# EAGLE board ESP32-P4 Display 10.1 inch V1.0 (EAGLE 9.6.2), part 1 of 4
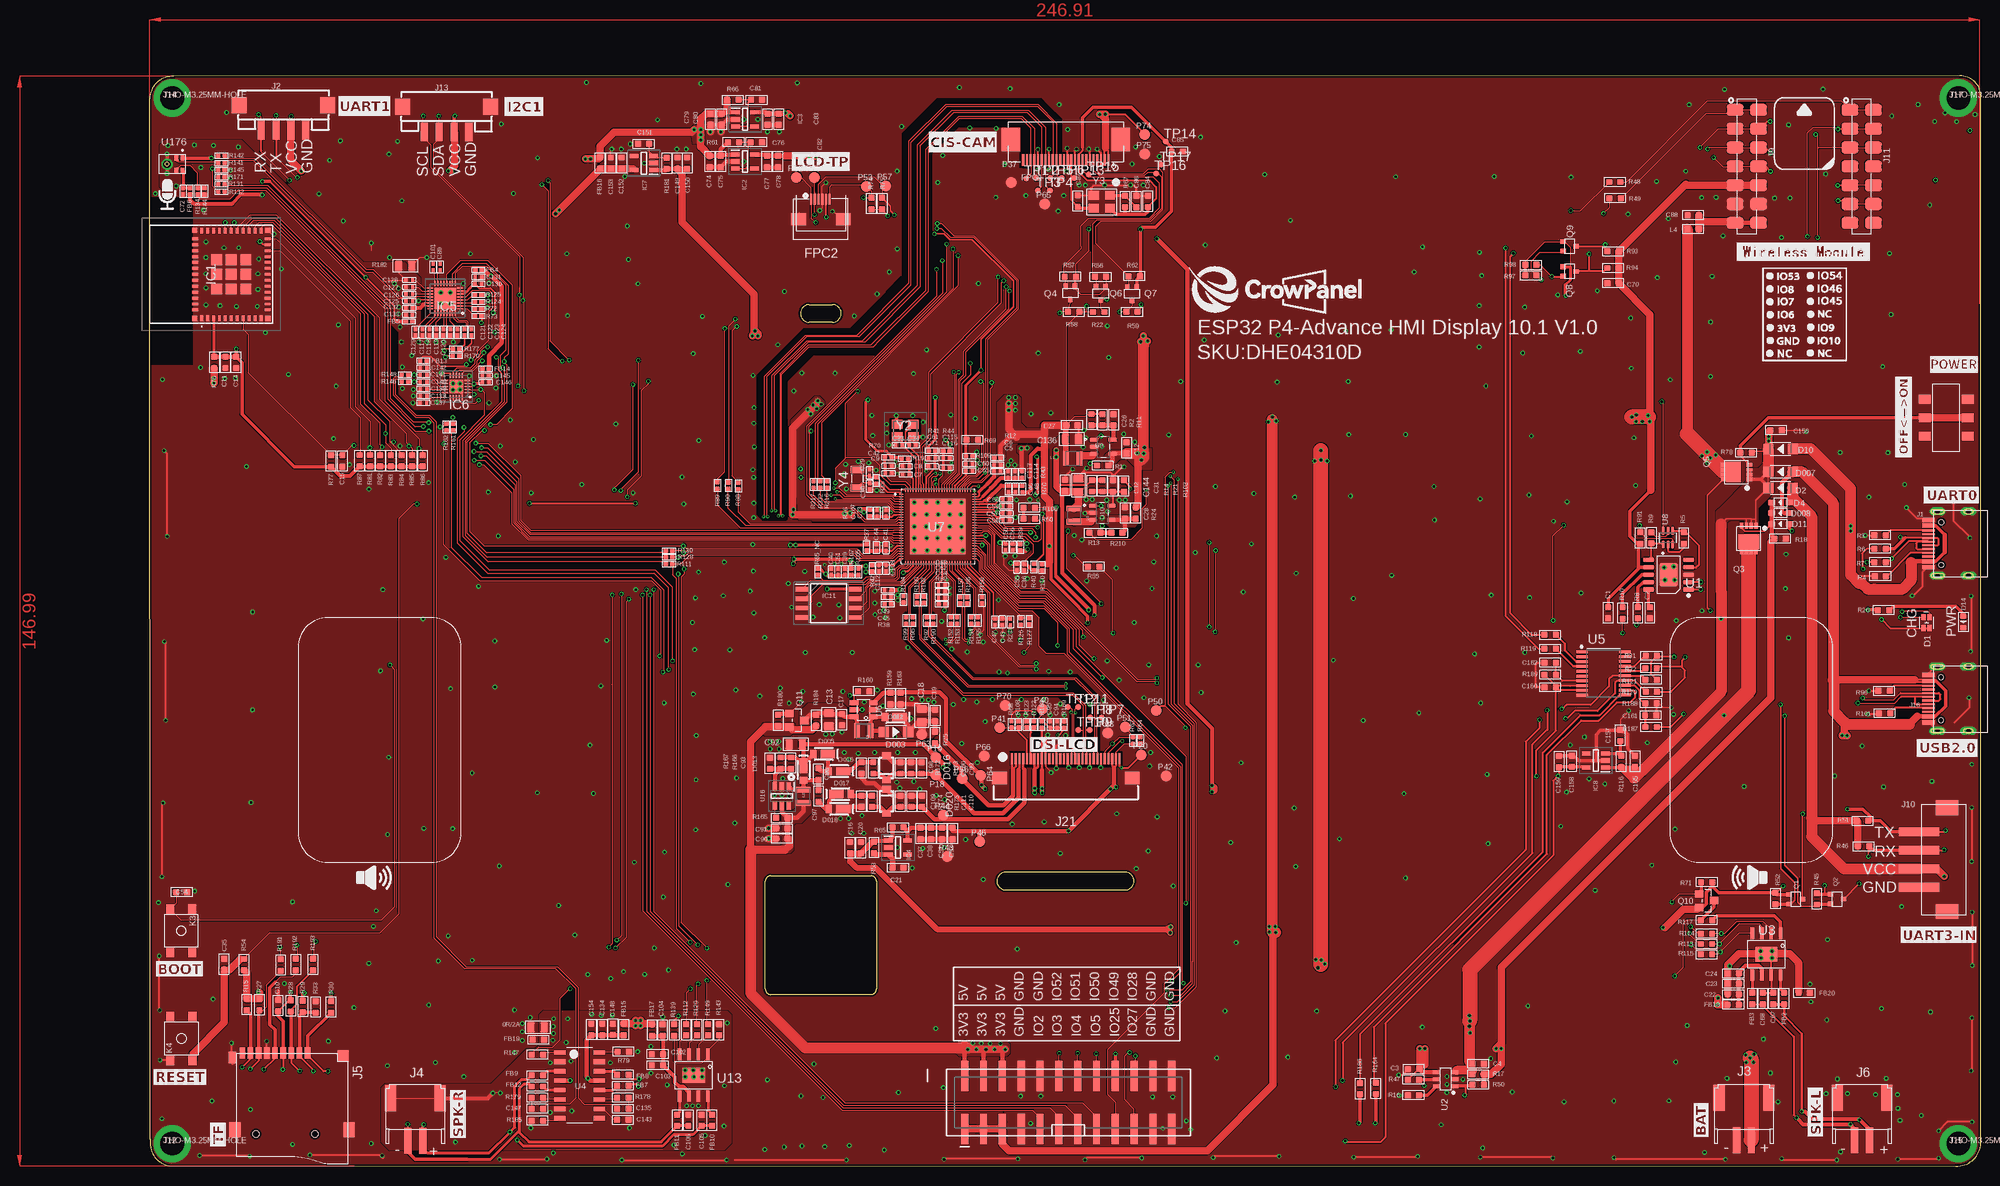
[diagram p10: board, top side]
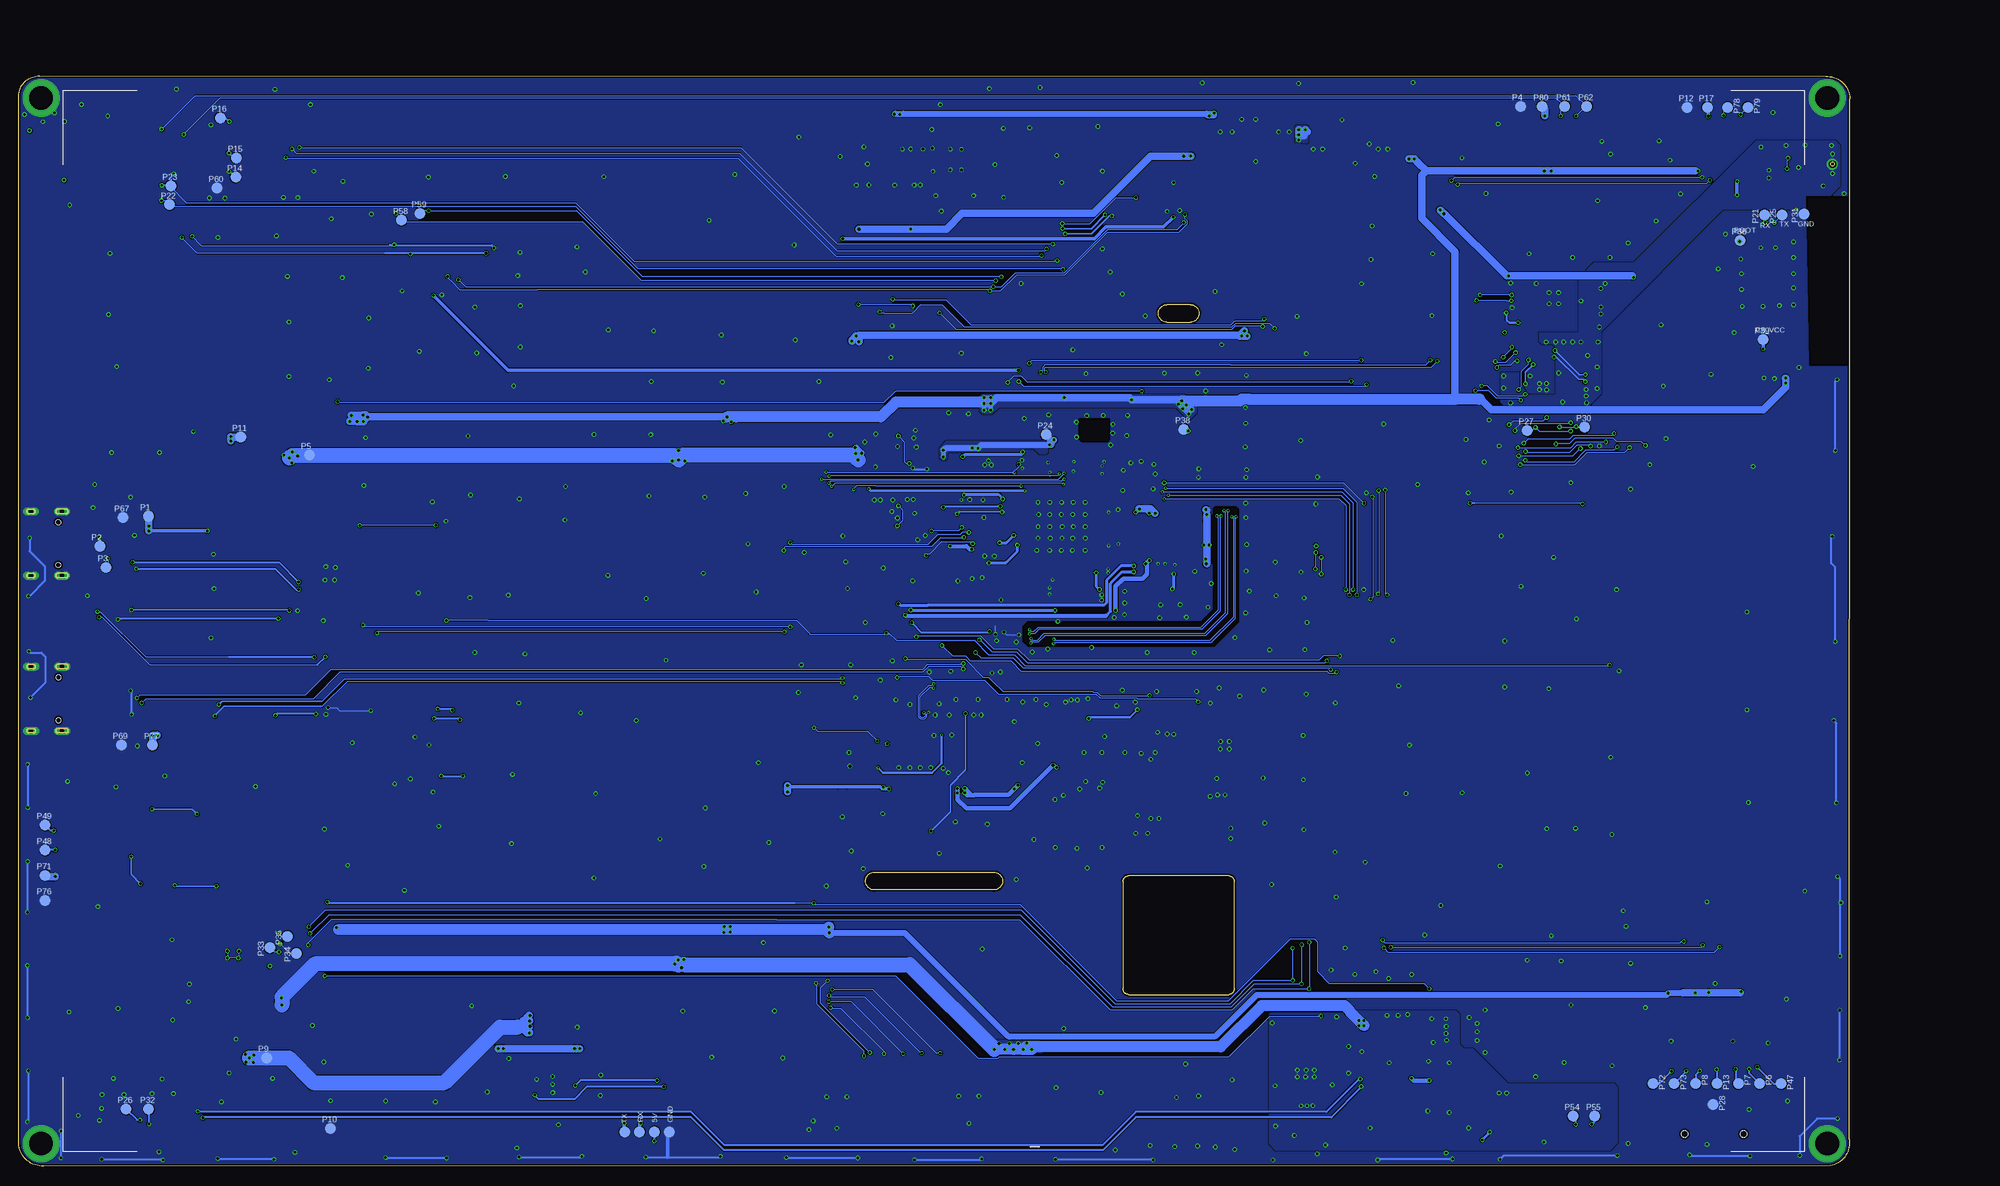
[diagram p11: board, bottom side, seen from below]

Size 247.04 x 147.01 mm. Coordinates in mm from the lower left corner, seen from the top.
Outline: 0.11,3.64 0,143.96 arc-90 3.28,146.96 244.18,147.01 arc-90 247.04,144.29 247.04,3.06 arc-90 243.64,0 2.67,0.03 arc-90 0.11,3.64
Outline: 115.49,37.24 131.61,37.24 arc180 131.61,39.62 115.49,39.62 arc180 115.49,37.24
Outline: 97.3,23.13 83.8,23.13 arc-90 83.05,23.88 83.05,38.38 arc-90 83.8,39.13 97.3,39.13 arc-90 98.05,38.38 98.05,23.88 arc-90 97.3,23.13
Outline: 92.11,113.8 88.99,113.8 arc-180 88.99,116.18 92.11,116.18 arc-180 92.11,113.8
Outline: circle at 2.38,135.11 radius 0.25
Copper layers (1*16): Top 0.035mm / dielectric 1.5mm / Bottom 0.035mm
Design rules "default *": minimum track width 4mil, minimum drill 0.2mm, track to track 4mil, track to pad 5mil, pad to pad 5mil, via to via 5mil, smd to smd 5mil, copper to edge 10mil, drill to drill 5mil, minimum pad ring 10mil, minimum via ring 4mil, stop-mask expansion 4mil, vias tented up to drill 30mil, thermal gap 6mil

## Footprints (pad centres in the part's own frame; a part is rotated, then mirrored left to right if it is on the bottom)
L0805 = smd 1.016 x 1.397: 1 -0.889,0; 2 0.889,0
0603 = smd 0.889 x 0.889: 1 -0.762,0; 2 0.762,0
C0402 = smd 0.6 x 0.6: 1 -0.45,0; 2 0.45,0
C0805 = smd 1.016 x 1.397: 1 -0.889,0; 2 0.889,0
0805 = smd 1.016 x 1.397: 1 -0.889,0; 2 0.889,0
LED_KT-0603RYG = smd 0.85 x 0.6: 1 0.725,-0.425; 2 0.725,0.425; 3 -0.725,-0.425; 4 -0.725,0.425
D_SOD123FL = smd 1.397 x 1.397: + -1.651,0; - 1.651,0
D_SOD323 = smd 1 x 0.8: + -1.2,0; - 1.2,0
LMBR140ET1G = smd 2 x 1.1: 1 -0.975,0 | smd 0.9 x 1.1: 2 0.975,0
LED0603 = smd 0.762 x 0.889: + -0.762,0; - 0.762,0
LMSZ5233BT1G = smd 0.91 x 1.22: 1 -1.635,0; 2 1.635,0
L0603 = smd 0.889 x 0.889: 1 -0.762,0; 2 0.762,0
L0402 = smd 0.635 x 0.635: 1 -0.445,0; 2 0.445,0
R0402 = smd 0.635 x 0.635: 1 -0.445,0; 2 0.445,0
FPC-SMD_P0.50-24P_QCHF-SM-H2.0 = smd 0.3 x 1.5: 1 5.75,-1.574; 2 5.25,-1.574; 3 4.75,-1.574; 4 4.25,-1.574; 5 3.75,-1.574; 6 3.25,-1.574; 7 2.75,-1.574; 8 2.25,-1.574; 9 1.75,-1.574; 10 1.25,-1.574; 11 0.75,-1.574; 12 0.25,-1.574; 13 -0.25,-1.574; 14 -0.75,-1.574; 15 -1.25,-1.574; 16 -1.75,-1.574; 17 -2.25,-1.574; 18 -2.75,-1.574; 19 -3.25,-1.574; 20 -3.75,-1.574; 21 -4.25,-1.574; 22 -4.75,-1.574; 23 -5.25,-1.574; 24 -5.75,-1.574 | smd 2.5 x 3.2: 25 7.4,1.195; 26 -7.4,1.195
FPC-6PIN-0.5MM = smd 0.3 x 1.5: 1 -1.31,2.184; 2 -0.81,2.184; 3 -0.31,2.184; 4 0.19,2.184; 5 0.69,2.184; 6 1.19,2.184 | smd 2 x 1.6: 7 -3.01,-0.496; 8 3.036,-0.496
ESP32C6MINI1N4 = smd 0.8 x 0.4: 1 -5.9,4; 2 -5.9,3.2; 3 -5.9,2.4; 4 -5.9,1.6; 5 -5.9,0.8; 6 -5.9,0; 7 -5.9,-0.8; 8 -5.9,-1.6; 9 -5.9,-2.4; 10 -5.9,-3.2; 11 -5.9,-4; 25 5.9,-4; 26 5.9,-3.2; 27 5.9,-2.4; 28 5.9,-1.6; 29 5.9,-0.8; 30 5.9,0; 31 5.9,0.8; 32 5.9,1.6; 33 5.9,2.4; 34 5.9,3.2; 35 5.9,4 | smd 0.4 x 0.8: 12 -4.8,-4.9; 13 -4,-4.9; 14 -3.2,-4.9; 15 -2.4,-4.9; 16 -1.6,-4.9; 17 -0.8,-4.9; 18 0,-4.9; 19 0.8,-4.9; 20 1.6,-4.9; 21 2.4,-4.9; 22 3.2,-4.9; 23 4,-4.9; 24 4.8,-4.9; 36 4.8,4.9; 37 4,4.9; 38 3.2,4.9; 39 2.4,4.9; 40 1.6,4.9; 41 0.8,4.9; 42 0,4.9; 43 -0.8,4.9; 44 -1.6,4.9; 45 -2.4,4.9; 46 -3.2,4.9; 47 -4,4.9; 48 -4.8,4.9 | smd 1.45 x 1.45: 49 0,0; 54 -1.975,1.975; 55 -1.975,0; 56 -1.975,-1.975; 57 0,-1.975; 58 1.975,-1.975; 59 1.975,0; 60 1.975,1.975; 61 0,1.975 | smd 0.7 x 0.7: 50 5.95,4.95; 51 5.95,-4.95; 52 -5.95,-4.95; 53 -5.95,4.95
SOT95P282X145-5N = smd 1.2 x 0.6: 1 -1.3,0.95; 2 -1.3,0; 3 -1.3,-0.95; 4 1.3,-0.95; 5 1.3,0.95
QFN40P400X400X80-33N = smd 0.75 x 0.2: 1 -2,1.4; 2 -2,1; 3 -2,0.6; 4 -2,0.2; 5 -2,-0.2; 6 -2,-0.6; 7 -2,-1; 8 -2,-1.4; 17 2,-1.4; 18 2,-1; 19 2,-0.6; 20 2,-0.2; 21 2,0.2; 22 2,0.6; 23 2,1; 24 2,1.4 | smd 0.2 x 0.75: 9 -1.4,-2; 10 -1,-2; 11 -0.6,-2; 12 -0.2,-2; 13 0.2,-2; 14 0.6,-2; 15 1,-2; 16 1.4,-2; 25 1.4,2; 26 1,2; 27 0.6,2; 28 0.2,2; 29 -0.2,2; 30 -0.6,2; 31 -1,2; 32 -1.4,2 | smd 2.9 x 2.9: 33 0,0
QFN40P300X300X60-21N = smd 0.75 x 0.2: 1 -1.5,0.8; 2 -1.5,0.4; 3 -1.5,0; 4 -1.5,-0.4; 5 -1.5,-0.8; 11 1.5,-0.8; 12 1.5,-0.4; 13 1.5,0; 14 1.5,0.4; 15 1.5,0.8 | smd 0.2 x 0.75: 6 -0.8,-1.5; 7 -0.4,-1.5; 8 0,-1.5; 9 0.4,-1.5; 10 0.8,-1.5; 16 0.8,1.5; 17 0.4,1.5; 18 0,1.5; 19 -0.4,1.5; 20 -0.8,1.5 | smd 1.8 x 1.8: 21 0,0
SOIC127P790X216-8N = smd 1.65 x 0.65: 1 -3.6,1.905; 2 -3.6,0.635; 3 -3.6,-0.635; 4 -3.6,-1.905; 5 3.6,-1.905; 6 3.6,-0.635; 7 3.6,0.635; 8 3.6,1.905
USB-3.0TYPEC-SMD = smd 0.3 x 1.7: A1 -3.35,0.5; A4 -2.55,0.5; A5 -1.25,0.5; A6 -0.25,0.5; A7 0.25,0.5; A8 1.25,0.5; A9 2.55,0.5; A12 3.35,0.5; B1 3.05,0.5; B4 2.25,0.5; B5 1.75,0.5; B6 0.75,0.5; B7 -0.75,0.5; B8 -1.75,0.5; B9 -2.25,0.5; B12 -3.05,0.5 | drill 0.6 pad 1.016 long: P$1 -4.325,-0.72; P$2 4.325,-0.72; P$3 -4.325,-4.9; P$4 4.325,-4.9 | hole 0.68: -2.89,-1.22; 2.89,-1.22
CONNECTOR_4P-SMD-2.0 = smd 0.965 x 2.54: 1 -3,0; 2 -1,0; 3 1,0; 4 3,0 | smd 2.032 x 2.184: SS1 -5.946,3.4; SS2 5.946,3.4
PH2.0WT-2PIN = smd 1 x 3.5: P$1 -1,0; P$2 1,0 | smd 1.5 x 3.5: P$3 -3.35,-5.7; P$4 3.35,-5.7
9P-SMD-W/-RING = smd 1.524 x 0.762: 1 0,4.4; 2 0,3.3; 3 0,2.2; 4 0,1.1; 5 0,0; 6 0,-1.1; 7 0,-2.2; 8 0,-3.3; 9 0,-4.4 | smd 1.524 x 1.016: G1 0.6,-5.746 | smd 2.032 x 1.524: G2 10.373,-5.4; G3 10.373,10 | smd 1.524 x 1.524: G4 0.392,9.181 | hole 0.889: 10.9,-2.6; 10.9,5.4
2X12-SMD1 = smd 4.14 x 0.991: 1 -3.569,13.97; 2 3.569,13.97; 3 -3.569,11.43; 4 3.569,11.43; 5 -3.569,8.89; 6 3.569,8.89; 7 -3.569,6.35; 8 3.569,6.35; 9 -3.569,3.81; 10 3.569,3.81; 11 -3.569,1.27; 12 3.569,1.27; 13 -3.569,-1.27; 14 3.569,-1.27; 15 -3.569,-3.81; 16 3.569,-3.81; 17 -3.569,-6.35; 18 3.569,-6.35; 19 -3.569,-8.89; 20 3.569,-8.89; 21 -3.569,-11.43; 22 3.569,-11.43; 23 -3.569,-13.97; 24 3.569,-13.97
TEST-PIN-4-2.0MM = smd 1.5 x 1.5: 1 -3,0; 2 -1,0; 3 1,0; 4 3,0
H7-2.54-18.28X2.5X5MM = smd 1.65 x 2.3: 1 -7.62,-1.58; 1-1 -7.62,1.58; 2 -5.08,-1.58; 2-2 -5.08,1.58; 3 -2.54,-1.58; 3-3 -2.54,1.58; 4 0,-1.58; 4-4 0,1.58; 5 2.54,-1.58; 5-5 2.54,1.58; 6 5.08,-1.58; 6-6 5.08,1.58; 7 7.62,-1.58; 7-7 7.62,1.58
XH2.54-4P-SMD = smd 1.2 x 5.5: 1 -3.75,-1.875; 2 -1.25,-1.875; 3 1.25,-1.875; 4 3.75,-1.875 | smd 2 x 3: 5 -7,1.875; 6 7,1.875
THO-M3.2*5MM-HOLE = drill 3.2 pad 5: P$1 0,0
C23398852_30P_0.5MM_下接_FC-05A30P11H20 = smd 0.3 x 1.5: 1 -7.25,1.3; 2 -6.75,1.3; 3 -6.25,1.3; 4 -5.75,1.3; 5 -5.25,1.3; 6 -4.75,1.3; 7 -4.25,1.3; 8 -3.75,1.3; 9 -3.25,1.3; 10 -2.75,1.3; 11 -2.25,1.3; 12 -1.75,1.3; 13 -1.25,1.3; 14 -0.75,1.3; 15 -0.25,1.3; 16 0.25,1.3; 17 0.75,1.3; 18 1.25,1.3; 19 1.75,1.3; 20 2.25,1.3; 21 2.75,1.3; 22 3.25,1.3; 23 3.75,1.3; 24 4.25,1.3; 25 4.75,1.3; 26 5.25,1.3; 27 5.75,1.3; 28 6.25,1.3; 29 6.75,1.3; 30 7.25,1.3 | smd 2 x 1.7: 31 8.95,-1.3; 32 -8.95,-1.3
KEY-4.5X4.5-SMD = smd 1.35 x 1.1: 1 -2.925,1.5; 2 -2.925,-1.5; 3 2.925,-1.5; 4 2.925,1.5
1008(2520) = smd 0.8 x 2: 1 -0.9,0; 2 0.9,0
TEST_PAD-1.5MM = smd 1.5 x 1.5: P$1 0,0
MOS_SOT323 = smd 0.635 x 0.762: 1 -0.635,-0.889; 2 0.635,-0.889; 3 0,0.889
PDFN3333 = smd 0.5 x 0.8: 1 -0.975,-1.725; 2 -0.325,-1.725; 4 0.975,-1.725; 5 0.975,1.725; 6 0.325,1.725; 7 -0.325,1.725; 8 -0.975,1.725 | smd 0.4 x 0.8: 3 0.325,-1.725 | smd 2.8 x 2: 9 0,0.4
PMOS_SOT23 = smd 1.016 x 1.143: 1 -0.889,-1.016; 2 0.889,-1.016; 3 0,1.016
R0603 = smd 0.889 x 0.889: 1 -0.762,0; 2 0.762,0
R0603-SP = smd 0.889 x 0.889: 1 -0.762,0; 2 0.762,0
R0805 = smd 1.016 x 1.397: 1 -0.889,0; 2 0.889,0
SWITCH_6PIN_2P = smd 1.2 x 1.6: 1 2.5,-2.9; 2 0,-2.9; 3 -2.5,-2.9; 4 -2.5,2.9; 5 0,2.9; 6 2.5,2.9
TP08R = smd 0.8 x 0.8: TP 0,0
ESOP-10-EP-150MIL = smd 1.5 x 0.6: 1 -2.7,2; 2 -2.7,1; 3 -2.7,0; 4 -2.7,-1; 5 -2.7,-2; 6 2.7,-2; 7 2.7,-1; 8 2.7,0; 9 2.7,1; 10 2.7,2 | smd 2.4 x 3.2: EP 0,0
SOT23-6L = smd 0.5 x 0.9: 1 -0.961,-1.212; 2 -0.011,-1.212; 3 0.94,-1.212; 4 0.94,1.288; 5 -0.011,1.288; 6 -0.961,1.288
NS4168-ESOP-8 = smd 1.6 x 0.5: 1 -2.8,1.905; 2 -2.8,0.635; 3 -2.8,-0.635; 4 -2.8,-1.905; 5 2.8,-1.905; 6 2.8,-0.635; 7 2.8,0.635; 8 2.8,1.905 | smd 2 x 3: 9 0,0
SOP16 = smd 0.635 x 1.524: 1 0,0; 2 1.27,0; 3 2.54,0; 4 3.81,0; 5 5.08,0; 6 6.35,0; 7 7.62,0; 8 8.89,0; 9 8.89,5.334; 10 7.62,5.334; 11 6.35,5.334; 12 5.08,5.334; 13 3.81,5.334; 14 2.54,5.334; 15 1.27,5.334; 16 0,5.334
TSSOP20 = smd 1.572 x 0.41: 1 -2.872,2.275; 2 -2.872,1.625; 3 -2.872,0.975; 4 -2.872,0.325; 5 -2.872,-0.325; 6 -2.872,-0.975; 7 -2.872,-1.625; 8 -2.872,-2.275; 9 -2.872,-2.895; 10 -2.872,-3.545; 11 2.872,-3.515; 12 2.872,-2.865; 13 2.872,-2.215; 14 2.872,-1.565; 15 2.872,-0.915; 16 2.872,-0.265; 17 2.872,0.355; 18 2.872,1.005; 19 2.872,1.625; 20 2.872,2.275
COOPER_SOT23-6 = smd 0.69 x 1.2: 1 -0.95,-1.3; 2 0,-1.3; 3 0.95,-1.3; 4 0.95,1.3; 5 0,1.3; 6 -0.95,1.3
IC_ESP32-P4NRW32 = smd 0.65 x 0.18: 1 -4.925,4.375; 2 -4.925,4.025; 3 -4.925,3.675; 4 -4.925,3.325; 5 -4.925,2.975; 6 -4.925,2.625; 7 -4.925,2.275; 8 -4.925,1.925; 9 -4.925,1.575; 10 -4.925,1.225; 11 -4.925,0.875; 12 -4.925,0.525; 13 -4.925,0.175; 14 -4.925,-0.175; 15 -4.925,-0.525; 16 -4.925,-0.875; 17 -4.925,-1.225; 18 -4.925,-1.575; 19 -4.925,-1.925; 20 -4.925,-2.275; 21 -4.925,-2.625; 22 -4.925,-2.975; 23 -4.925,-3.325; 24 -4.925,-3.675; 25 -4.925,-4.025; 26 -4.925,-4.375; 53 4.925,-4.375; 54 4.925,-4.025; 55 4.925,-3.675; 56 4.925,-3.325; 57 4.925,-2.975; 58 4.925,-2.625; 59 4.925,-2.275; 60 4.925,-1.925; 61 4.925,-1.575; 62 4.925,-1.225; 63 4.925,-0.875; 64 4.925,-0.525; 65 4.925,-0.175; 66 4.925,0.175; 67 4.925,0.525; 68 4.925,0.875; 69 4.925,1.225; 70 4.925,1.575; 71 4.925,1.925; 72 4.925,2.275; 73 4.925,2.625; 74 4.925,2.975; 75 4.925,3.325; 76 4.925,3.675; 77 4.925,4.025; 78 4.925,4.375 | smd 0.18 x 0.65: 27 -4.375,-4.925; 28 -4.025,-4.925; 29 -3.675,-4.925; 30 -3.325,-4.925; 31 -2.975,-4.925; 32 -2.625,-4.925; 33 -2.275,-4.925; 34 -1.925,-4.925; 35 -1.575,-4.925; 36 -1.225,-4.925; 37 -0.875,-4.925; 38 -0.525,-4.925; 39 -0.175,-4.925; 40 0.175,-4.925; 41 0.525,-4.925; 42 0.875,-4.925; 43 1.225,-4.925; 44 1.575,-4.925; 45 1.925,-4.925; 46 2.275,-4.925; 47 2.625,-4.925; 48 2.975,-4.925; 49 3.325,-4.925; 50 3.675,-4.925; 51 4.025,-4.925; 52 4.375,-4.925; 79 4.375,4.925; 80 4.025,4.925; 81 3.675,4.925; 82 3.325,4.925; 83 2.975,4.925; 84 2.625,4.925; 85 2.275,4.925; 86 1.925,4.925; 87 1.575,4.925; 88 1.225,4.925; 89 0.875,4.925; 90 0.525,4.925; 91 0.175,4.925; 92 -0.175,4.925; 93 -0.525,4.925; 94 -0.875,4.925; 95 -1.225,4.925; 96 -1.575,4.925; 97 -1.925,4.925; 98 -2.275,4.925; 99 -2.625,4.925; 100 -2.975,4.925; 101 -3.325,4.925; 102 -3.675,4.925; 103 -4.025,4.925; 104 -4.375,4.925 | smd 7.5 x 7.5: 105 0,0
SOP65P210X100-6N = smd 1.09 x 0.4: 1 -0.92,0.65; 2 -0.92,0; 3 -0.92,-0.65; 4 0.92,-0.65; 5 0.92,0; 6 0.92,0.65
SOT95P280X145-5N = smd 1.21 x 0.59: 1 -1.255,0.95; 2 -1.255,0; 3 -1.255,-0.95; 4 1.255,-0.95; 5 1.255,0.95
SOT95P280X145-6N = smd 1.2 x 0.6: 1 -1.25,0.95; 2 -1.25,0; 3 -1.25,-0.95; 4 1.25,-0.95; 5 1.25,0; 6 1.25,0.95
BRAIN1_MIC-SMD_5P-L3.5-W2.7 = smd 0.725 x 0.522: 1 -0.838,1.362; 2 -0.838,0.542; 3 0.838,0.542; 4 0.838,1.362 | drill 1: P$1 0.013,-0.711
X322540MPB4SI = smd 1.4 x 1.2: 1 -1.1,-0.85; 2 1.1,-0.85; 3 1.1,0.85; 4 -1.1,0.85
24MHZ_1631-24003-BTKEYA = smd 1.4 x 1.2: 1 -1.1,-0.875; 2 1.1,-0.875; 3 1.1,0.875; 4 -1.1,0.875
NORDIC_NRF_XTAL_3215_N = smd 1 x 1.8: 1 -1.25,0; 2 1.25,0

## Placement (x,y rotation side)
0R/2A  0R/800mA  [L0805]  52.35,18.73 0 top
C1  1uF  [0603]  196.75,74.62 90 top
C2  1uF  [0603]  202.37,74.62 90 top
C3  1uF  [0603]  170.5,13.08 0 top
C4  10uF/NC  [0603]  179.2,13.79 180 top
C5  100nF  [C0402]  114.35,93.68 0 top
C6  10uF  [C0402]  114.36,94.58 180 top
C7  100nF  [C0402]  102.03,93.26 180 top
C8  10uF  [C0402]  102.03,94.35 0 top
C9  100nF  [C0402]  99.69,93.4 0 top
C10  1uF  [0603]  17.33,21.63 270 top
C11  100nF  [0603]  10.24,108.38 270 top
C12  10uF/10V+  [0603]  131.79,96.86 90 top
C13  22uF  [C0805]  91.64,60.2 270 top
C14  10uF  [0603]  11.67,108.38 90 top
C15  100nF  [0603]  26.02,95.08 270 top
C16  10uF  [0603]  94.48,42.94 270 top
C17  1uF  [0603]  93.39,60.2 90 top
C18  22uF  [C0805]  104.18,60.74 90 top
C19  100nF  [0603]  105.97,60.77 90 top
C20  100nF  [0603]  95.95,42.94 270 top
C21  100nF  [0603]  100.97,40.22 180 top
C22  1uF_NC  [0603]  213.62,23.16 180 top
C23  47uF_NC  [0603]  213.62,24.59 180 top
C24  47uF_NC  [0603]  213.62,25.99 180 top
C26  22pF  [0603]  127.08,100.66 90 top
C27  10uF/10V+  [0603]  124.44,99.91 180 top
C28  10uF/10V+  [0603]  131.59,88.06 90 top
C29  12pF  [C0402]  97.12,93.51 90 top
C30  12pF  [C0402]  97.13,91.68 270 top
C31  22pF  [0603]  127.1,91.73 90 top
C32  10uF/10V+  [0603]  123.51,91.81 270 top
C33  15pF  [C0402]  101.07,97.2 180 top
C34  15pF  [C0402]  102.91,97.2 180 top
C35  100nF  [0603]  10.06,27.22 270 top
C36  100nF  [C0402]  118,80.75 270 top
C37  100nF  [0603]  104.01,44.85 90 top
C38  10uF  [0603]  105.44,44.85 90 top
C39  100nF_NC  [C0402]  93.77,80.14 90 top
C40  100nF  [C0402]  91.97,80.14 90 top
C41  100nF  [C0402]  99.35,83.39 90 top
C42  10uF  [C0402]  99.67,94.42 180 top
C43  100nF  [C0402]  115.04,73.39 270 top
C44  10uF  [C0402]  98.04,83.42 270 top
C45  100nF  [C0402]  99.59,76.74 180 top
C46  100nF  [C0402]  115.87,91.3 270 top
C47  10uF  [C0402]  114.04,73.38 90 top
C48  10uF  [C0402]  116.81,91.3 90 top
C49  10uF  [C0402]  99.59,77.66 0 top
C50  100nF  [C0402]  115.46,83.48 270 top
C51  1uF  [C0402]  92.87,80.14 90 top
C52  100nF  [0603]  106.89,44.85 90 top
C53  100nF  [0603]  108.32,44.85 90 top
C54  100nF  [0603]  4.33,36.93 180 top
C55  1uF  [C0402]  116.98,80.76 270 top
C56  10uF  [C0402]  116.46,83.48 90 top
C57  1uF  [C0402]  115.58,88.04 0 top
C58  1uF  [C0402]  115.58,87.08 0 top
C59  1uF  [C0402]  115.58,88.98 0 top
C60  100nF  [C0402]  110.56,94.69 0 top
C61  100nF  [C0402]  105.53,95.45 180 top
C62  10nF  [C0402]  106.89,77.49 0 top
C63  100nF  [C0402]  106.88,78.36 0 top
C64  1uF  [C0402]  106.87,76.66 0 top
C65  1uF  [C0402]  110.56,93.77 0 top
C66  1uF  [C0402]  115.58,89.9 0 top
C67  1nF  [0603]  219.03,22.59 270 top
C68  1nF  [0603]  217.61,22.59 270 top
C70  10UF  [0603]  197.42,119.06 180 top
C71  10uF  [C0402]  105.51,94.36 0 top
C72  100nF  [C0402]  4.52,131.45 90 top
C73  100nF  [C0402]  99.35,88.07 90 top
C74  10uF  [0603]  75.57,135.46 90 top
C75  100nF  [0603]  77.04,135.46 90 top
C76  100nF  [0603]  81.86,138.08 180 top
C77  100nF  [0603]  83.28,135.46 90 top
C78  10uF  [0603]  84.77,135.46 90 top
C79  10uF  [0603]  75.67,141.16 90 top
C80  100nF  [0603]  77.18,141.16 90 top
C81  100nF  [0603]  81.89,143.78 180 top
C82  100nF  [0603]  83.37,141.16 90 top
C83  10uF  [0603]  84.87,141.16 90 top
C84  100nF  [0603]  134.66,130.1 270 top
C85  1nF  [0603]  138.64,136.82 180 top
C86  1uF  [0603]  133.12,130.08 270 top
C87  15pF  [0603]  125.2,130.15 270 top
C88  10UF_NC  [0603]  208.23,128.25 180 top
C89  22pF  [C0402]  39.21,121.25 90 top
C90  10uF/25V  [0603]  85.28,44.17 180 top
C91  100nF/50V  [0603]  85.28,45.55 180 top
C92  22uF/16V  [C0805]  87.17,56.88 180 top
C93  10nF/25V  [0603]  86.52,54.34 270 top
C94  10uF/25V  [C0402]  122.42,59.55 90 top
C95  100nF/50V  [C0402]  121.49,59.55 90 top
C96  1uF/25V  [0603]  90.23,52.86 90 top
C97  1uF/25V  [0603]  90.24,49.9 270 top
C98  1uF/50V  [0603]  96.02,53.7 270 top
C99  10uF/25V  [0603]  104.16,53.7 90 top
C100  100nF/50V  [0603]  102.74,53.7 90 top
C101  22pF  [C0402]  38.26,121.25 90 top
C102  1uF_NC  [0603]  68.52,15.09 180 top
C103  47uF_NC  [0603]  68.52,13.59 180 top
C104  47uF_NC  [0603]  69.21,18.36 90 top
C105  1nF  [0603]  74.47,6.18 270 top
C106  1nF  [0603]  72.68,6.18 270 top
C107  10uF  [C0402]  98.13,88.07 270 top
C108  100nF  [C0402]  99.35,80.61 270 top
C109  1uF/50V  [0603]  96.03,49.19 270 top
C110  10uF/25V  [0603]  104.2,49.19 90 top
C111  100nF/50V  [0603]  102.8,49.19 90 top
C112  10uF  [C0402]  98.4,80.61 90 top
C113  100nF  [C0402]  115.81,93.25 90 top
C114  10uF  [C0402]  116.74,93.25 270 top
C115  100nF  [C0402]  107.5,95.48 0 top
C116  10uF  [C0402]  107.51,94.2 180 top
C117  1uF  [C0402]  36.8,112.45 90 top
C118  1uF  [C0402]  37.75,112.45 90 top
C119  1uF  [C0402]  38.69,112.45 90 top
C120  1uF  [C0402]  39.64,112.45 90 top
C121  1uF  [C0402]  40.58,112.45 90 top
C122  1uF  [C0402]  41.53,112.45 90 top
C123  1uF  [C0402]  42.47,112.45 90 top
C124  1uF  [C0402]  43.42,112.45 90 top
C125  1uF  [C0402]  35.03,116.65 180 top
C126  1uF  [C0402]  35.03,117.59 180 top
C127  1uF  [C0402]  35.03,118.54 180 top
C128  1uF  [C0402]  35.03,119.48 180 top
C129  1uF  [C0402]  35.85,112.44 270 top
C130  100nF  [C0402]  44.36,118.96 0 top
C131  1uF  [C0402]  44.37,119.91 180 top
C132  100nF  [C0402]  35.03,115.71 180 top
C133  1uF  [C0402]  35.02,114.8 0 top
C134  47uF  [0603]  61.09,18.42 270 top
C135  100nF  [0603]  63.85,7.73 0 top
C136  22uF  [0805]  124.42,98.04 180 top
C137  1uF  [C0402]  36.94,102.93 0 top
C138  1uF  [C0402]  36.95,103.88 180 top
C139  1uF  [C0402]  36.95,104.83 180 top
C140  1uF  [C0402]  36.95,105.77 180 top
C141  1uF  [C0402]  36.95,106.72 180 top
C142  1uF  [C0402]  36.95,107.66 180 top
C143  1uF  [0603]  63.85,6.23 180 top
C144  22uF  [0805]  125.29,91.81 270 top
C145  100nF  [C0402]  45.34,106.61 0 top
C146  1uF  [C0402]  45.35,105.7 180 top
C147  100nF  [0603]  52.31,7.75 180 top
C148  47uF  [0603]  62.5,18.44 270 top
C149  10uF  [0603]  71.2,135.25 270 top
C150  100nF  [0603]  72.54,135.25 270 top
C151  100nF  [0603]  66.65,137.84 0 top
C152  100nF  [0603]  63.69,135.25 270 top
C153  10uF  [0603]  62.23,135.25 270 top
C154  100nF  [0603]  59.6,18.42 90 top
C155  10uF  [0603]  200.37,54.59 270 top
C156  100nF  [0603]  219.39,99.24 180 top
C157  100nF  [0603]  198.37,58.08 270 top
C158  100nF  [0603]  191.84,54.59 270 top
C159  10uF  [0603]  190.11,54.54 270 top
C160  1uF  [0603]  188.91,64.57 0 top
C161  1nF  [0603]  202.5,60.8 180 top
C162  100nF  [0603]  188.91,67.89 0 top
D1  KT-0603RYG  [LED_KT-0603RYG]  239.7,73.28 270 top
D2  DSS34  [D_SOD123FL]  220,91.45 180 top
D003  NC/DSS34  [D_SOD123FL]  100.7,58.54 0 top
D4  1N5817WS  [D_SOD323]  220,89.5 180 top
D005  LMBR140ET1G  [LMBR140ET1G]  90.52,55.57 180 top
D007  DSS34  [D_SOD123FL]  220,93.63 180 top
D008  1N5817WS  [D_SOD323]  220,88.05 180 top
D10  DSS34  [D_SOD123FL]  220,96.68 180 top
D11  1N5817WS  [D_SOD323]  220,86.6 180 top
D012  LMBR140ET1G  [LMBR140ET1G]  100.2,60.57 180 top
D013  LMBR140ET1G  [LMBR140ET1G]  88.22,53.01 270 top
D14  Red  [LED0603]  244.66,73.37 270 top
D015  LMBR140ET1G  [LMBR140ET1G]  92.62,53.24 180 top
D016  MM1W18_18V  [LMSZ5233BT1G]  99.42,53.7 90 top
D017  LMBR140ET1G  [LMBR140ET1G]  93.62,50.17 0 top
D018  LMBR140ET1G  [LMBR140ET1G]  92.62,48.15 180 top
D020  LMSZ5233BT1G_-6V  [LMSZ5233BT1G]  99.4,49.19 270 top
FB2  1K/磁珠_NC  [L0603]  220.48,22.59 270 top
FB3  1K/磁珠_NC  [L0603]  216.2,22.59 270 top
FB4  0R/800mA  [L0402]  44.38,120.84 180 top
FB5  0R/800mA  [L0402]  35,113.9 0 top
FB6  0R/800mA  [L0402]  5.44,131.45 90 top
FB7  1K/磁珠  [L0603]  63.85,10.83 0 top
FB8  1K/磁珠  [L0603]  63.85,12.33 0 top
FB9  1K/磁珠  [L0603]  52.3,12.23 180 top
FB10  1K/磁珠_NC  [L0603]  75.87,6.18 270 top
FB11  1K/磁珠_NC  [L0603]  71.18,6.18 270 top
FB12  1K/磁珠  [L0603]  52.3,10.73 180 top
FB13  0R/800mA  [L0402]  36.96,108.62 180 top
FB14  0R/800mA  [R0402]  45.33,107.52 180 top
FB15  0R/2A  [L0603]  63.97,18.42 270 top
FB16  0R/800mA_NC  [L0603]  60.75,135.25 270 top
FB17  0R/2A  [L0603]  67.79,18.36 90 top
FB18  0R/2A  [L0603]  213.62,21.78 180 top
FB19  0R/2A  [L0603]  52.45,17.03 0 top
FB20  0R/2A  [L0603]  223.2,23.35 180 top
FPC1  AFC24-S24FIA-00  [FPC-SMD_P0.50-24P_QCHF-SM-H2.0]  123.59,137.25 0 top
FPC2  FPC-6PIN-0.5MM  [FPC-6PIN-0.5MM]  90.55,128.18 0 top
IC1  ESP32-C6-MINI-1-N4  [ESP32C6MINI1N4]  11.03,120.25 90 top
IC2  ME6211C18M5G-N  [SOT95P282X145-5N]  80.32,135.46 0 top
IC3  ME6211C28M5G-N  [SOT95P282X145-5N]  80.33,141.16 0 top
IC4  ME6211C18M5G-N_NC  [SOT95P282X145-5N]  100.97,42.95 0 top
IC5  ES7210  [QFN40P400X400X80-33N]  39.88,117.01 180 top
IC6  ES8311  [QFN40P300X300X60-21N]  41.38,105.11 180 top
IC7  ME6211C33M5G-N  [SOT95P282X145-5N]  66.68,135.25 180 top
IC8  ME6211C33M5G-N  [SOT95P282X145-5N]  195.08,54.68 180 top
IC11  W25Q128JVSIQ  [SOIC127P790X216-8N]  91.59,75.89 0 top
J1  TYPEC-3.0-16P-SMD  [USB-3.0TYPEC-SMD]  240.47,83.95 90 top
J2  HY2.0-4P-SMT  [CONNECTOR_4P-SMD-2.0]  18.07,139.67 0 top
J3  PH2.0WT-2PIN  [PH2.0WT-2PIN]  215.07,3.49 180 top
J4  PH2.0WT-2PIN  [PH2.0WT-2PIN]  35.85,3.44 180 top
J5  [9P-SMD-W/-RING]  16.93,15.24 270 top
J6  PH2.0WT-2PIN  [PH2.0WT-2PIN]  230.99,3.49 180 top
J7  CONN_12X22X12-SMD1  [2X12-SMD1]  123.93,8.57 90 top
J8  HC-PZ200-8.7L-1X4PZ1  [TEST-PIN-4-2.0MM]  162.27,4.6 0 bottom
J9  [H7-2.54-18.28X2.5X5MM]  215.46,134.81 270 top
J10  XH2.54-4P-SMT  [XH2.54-4P-SMD]  240.58,41.32 270 top
J11  [H7-2.54-18.28X2.5X5MM]  230.96,134.81 270 top
J12  THO-M3.25MM-HOLE  [THO-M3.2*5MM-HOLE]  3.05,3.03 0 top
J13  HY2.0-4P-SMT  [CONNECTOR_4P-SMD-2.0]  40.07,139.45 0 top
J14  THO-M3.25MM-HOLE  [THO-M3.2*5MM-HOLE]  3.05,144.03 0 top
J15  THO-M3.25MM-HOLE  [THO-M3.2*5MM-HOLE]  244,3.03 0 top
J16  TYPEC-3.0-16P-SMD  [USB-3.0TYPEC-SMD]  240.44,63.02 90 top
J17  THO-M3.25MM-HOLE  [THO-M3.2*5MM-HOLE]  244,144.03 0 top
J21  C23398852_30P_0.5MM_下接_FC-05A30P11H20  [C23398852_30P_0.5MM_下接_FC-05A30P11H20]  123.6,53.64 0 top
K3  KEY-4.5X4.5  [KEY-4.5X4.5-SMD]  4.27,31.73 270 top
K4  KEY-4.5X4.5  [KEY-4.5X4.5-SMD]  4.3,17.22 90 top
L1  2.2μH_C5179446  [1008(2520)]  124.54,95.41 180 top
L2  4.7uH_C45385206_2.4A  [1008(2520)]  88.19,49.86 90 top
L4  NC  [L0603]  208.21,126.34 180 top
L5  4.7uH_C45385206_2.4A  [1008(2520)]  96.33,58.69 0 top
L6  2.2μH_C5179446  [1008(2520)]  124.72,87.77 90 top
P1  TEST_PADPAD-1.5MM  [TEST_PAD-1.5MM]  229.49,87.63 0 bottom
P2  TEST_PADPAD-1.5MM  [TEST_PAD-1.5MM]  236.06,83.58 0 bottom
P3  TEST_PADPAD-1.5MM  [TEST_PAD-1.5MM]  235.23,80.74 0 bottom
P4  TEST_PADPAD-1.5MM  [TEST_PAD-1.5MM]  44.43,142.92 0 bottom
P5  TEST_PADPAD-1.5MM  [TEST_PAD-1.5MM]  207.8,95.88 0 bottom
P6  TEST_PADPAD-1.5MM  [TEST_PAD-1.5MM]  12.17,11.13 270 bottom
P7  TEST_PADPAD-1.5MM  [TEST_PAD-1.5MM]  15.05,11.13 270 bottom
P8  TEST_PADPAD-1.5MM  [TEST_PAD-1.5MM]  20.81,11.13 270 bottom
P9  TEST_PADPAD-1.5MM  [TEST_PAD-1.5MM]  213.57,14.6 0 bottom
P10  TEST_PADPAD-1.5MM  [TEST_PAD-1.5MM]  204.95,5.09 0 bottom
P11  TEST_PADPAD-1.5MM  [TEST_PAD-1.5MM]  217.08,98.31 0 bottom
P12  TEST_PADPAD-1.5MM  [TEST_PAD-1.5MM]  21.96,142.78 0 bottom
P13  TEST_PADPAD-1.5MM  [TEST_PAD-1.5MM]  17.93,11.13 270 bottom
P14  TEST_PADPAD-1.5MM  [TEST_PAD-1.5MM]  217.75,133.36 0 bottom
P15  TEST_PADPAD-1.5MM  [TEST_PAD-1.5MM]  217.66,135.96 0 bottom
P16  TEST_PADPAD-1.5MM  [TEST_PAD-1.5MM]  219.83,141.37 0 bottom
P17  TEST_PADPAD-1.5MM  [TEST_PAD-1.5MM]  19.23,142.78 0 bottom
P18  TEST_PADPAD-1.5MM  [TEST_PAD-1.5MM]  106.03,52.73 180 top
P19  TEST_PADPAD-1.5MM  [TEST_PAD-1.5MM]  106.06,55.09 0 top
P20  TEST_PADPAD-1.5MM  [TEST_PAD-1.5MM]  133.78,55.45 0 top
P21  TEST_PADPAD-1.5MM  [TEST_PAD-1.5MM]  11.55,128.28 90 bottom
P22  TEST_PADPAD-1.5MM  [TEST_PAD-1.5MM]  226.68,129.64 0 bottom
P23  TEST_PADPAD-1.5MM  [TEST_PAD-1.5MM]  226.48,132.17 0 bottom
P24  TEST_PADPAD-1.5MM  [TEST_PAD-1.5MM]  108.43,98.64 0 bottom
P25  TEST_PADPAD-1.5MM  [TEST_PAD-1.5MM]  9.17,128.28 90 bottom
P26  TEST_PADPAD-1.5MM  [TEST_PAD-1.5MM]  232.53,7.69 0 bottom
P27  TEST_PADPAD-1.5MM  [TEST_PAD-1.5MM]  43.55,99.19 0 bottom
P28  TEST_PADPAD-1.5MM  [TEST_PAD-1.5MM]  18.47,8.31 270 bottom
P30  TEST_PADPAD-1.5MM  [TEST_PAD-1.5MM]  35.77,99.65 0 bottom
P31  TEST_PADPAD-1.5MM  [TEST_PAD-1.5MM]  6.22,128.38 90 bottom
P32  TEST_PADPAD-1.5MM  [TEST_PAD-1.5MM]  229.49,7.69 0 bottom
P33  TEST_PADPAD-1.5MM  [TEST_PAD-1.5MM]  213.13,29.47 90 bottom
P34  TEST_PADPAD-1.5MM  [TEST_PAD-1.5MM]  209.54,28.69 90 bottom
P35  TEST_PADPAD-1.5MM  [TEST_PAD-1.5MM]  210.74,30.98 90 bottom
P36  TEST_PADPAD-1.5MM  [TEST_PAD-1.5MM]  14.81,124.82 0 bottom
P37  TEST_PADPAD-1.5MM  [TEST_PAD-1.5MM]  116.23,132.61 0 top
P38  TEST_PADPAD-1.5MM  [TEST_PAD-1.5MM]  89.86,99.35 0 bottom
P39  TEST_PADPAD-1.5MM  [TEST_PAD-1.5MM]  11.71,111.45 0 bottom
P40  TEST_PADPAD-1.5MM  [TEST_PAD-1.5MM]  120.44,61.62 0 top
P41  TEST_PADPAD-1.5MM  [TEST_PAD-1.5MM]  114.71,59.13 0 top
P42  TEST_PADPAD-1.5MM  [TEST_PAD-1.5MM]  137.15,52.62 0 top
P43  TEST_PADPAD-1.5MM  [TEST_PAD-1.5MM]  107.6,41.73 0 top
P44  TEST_PADPAD-1.5MM  [TEST_PAD-1.5MM]  107.09,47.37 0 top
P45  TEST_PADPAD-1.5MM  [TEST_PAD-1.5MM]  89.7,133.34 0 top
P46  TEST_PADPAD-1.5MM  [TEST_PAD-1.5MM]  111.98,43.74 0 top
P47  TEST_PADPAD-1.5MM  [TEST_PAD-1.5MM]  9.29,11.13 270 bottom
P48  TEST_PADPAD-1.5MM  [TEST_PAD-1.5MM]  243.44,42.6 0 bottom
P49  TEST_PADPAD-1.5MM  [TEST_PAD-1.5MM]  243.44,45.99 0 bottom
P50  TEST_PADPAD-1.5MM  [TEST_PAD-1.5MM]  135.8,61.44 0 top
P51  TEST_PADPAD-1.5MM  [TEST_PAD-1.5MM]  131.63,59.22 0 top
P52  TEST_PADPAD-1.5MM  [TEST_PAD-1.5MM]  87.27,133.33 0 top
P53  TEST_PADPAD-1.5MM  [TEST_PAD-1.5MM]  96.68,132.13 0 top
P54  TEST_PADPAD-1.5MM  [TEST_PAD-1.5MM]  37.35,6.75 0 bottom
P55  TEST_PADPAD-1.5MM  [TEST_PAD-1.5MM]  34.44,6.74 0 bottom
P56  TEST_PADPAD-1.5MM  [TEST_PAD-1.5MM]  109.65,52.28 0 top
P57  TEST_PADPAD-1.5MM  [TEST_PAD-1.5MM]  99.31,132.18 0 top
P58  TEST_PADPAD-1.5MM  [TEST_PAD-1.5MM]  195.37,127.57 0 bottom
P59  TEST_PADPAD-1.5MM  [TEST_PAD-1.5MM]  192.88,128.48 0 bottom
P60  TEST_PADPAD-1.5MM  [TEST_PAD-1.5MM]  220.27,131.88 0 bottom
P61  TEST_PADPAD-1.5MM  [TEST_PAD-1.5MM]  38.48,142.92 0 bottom
P62  TEST_PADPAD-1.5MM  [TEST_PAD-1.5MM]  35.5,142.92 0 bottom
P63  TEST_PADPAD-1.5MM  [TEST_PAD-1.5MM]  104.19,58.18 180 top
P64  TEST_PADPAD-1.5MM  [TEST_PAD-1.5MM]  112.12,52.69 270 top
P65  TEST_PADPAD-1.5MM  [TEST_PAD-1.5MM]  120.77,129.75 0 top
P66  TEST_PADPAD-1.5MM  [TEST_PAD-1.5MM]  112.61,55.29 0 top
P67  TEST_PADPAD-1.5MM  [TEST_PAD-1.5MM]  232.97,87.45 0 bottom
P68  TEST_PADPAD-1.5MM  [TEST_PAD-1.5MM]  129.23,58.41 0 top
P69  TEST_PADPAD-1.5MM  [TEST_PAD-1.5MM]  233.18,56.79 0 bottom
P70  TEST_PADPAD-1.5MM  [TEST_PAD-1.5MM]  115.4,62.13 0 top
P71  TEST_PADPAD-1.5MM  [TEST_PAD-1.5MM]  243.44,39.21 0 bottom
P72  TEST_PADPAD-1.5MM  [TEST_PAD-1.5MM]  26.57,11.13 270 bottom
P73  TEST_PADPAD-1.5MM  [TEST_PAD-1.5MM]  23.69,11.13 270 bottom
P74  TEST_PADPAD-1.5MM  [TEST_PAD-1.5MM]  134.24,139.08 0 top
P75  TEST_PADPAD-1.5MM  [TEST_PAD-1.5MM]  134.27,136.47 0 top
P76  TEST_PADPAD-1.5MM  [TEST_PAD-1.5MM]  243.44,35.82 0 bottom
P77  TEST_PADPAD-1.5MM  [TEST_PAD-1.5MM]  228.95,56.76 0 bottom
P78  TEST_PADPAD-1.5MM  [TEST_PAD-1.5MM]  16.49,142.78 270 bottom
P79  TEST_PADPAD-1.5MM  [TEST_PAD-1.5MM]  13.76,142.78 270 bottom
P80  TEST_PADPAD-1.5MM  [TEST_PAD-1.5MM]  41.54,142.89 0 bottom
Q1  BSS138W_SOT323  [MOS_SOT323]  222.06,35.98 270 top
Q2  BSS138W_SOT323  [MOS_SOT323]  227.62,36.01 270 top
Q3  XR65P02D  [PDFN3333]  215.72,84.61 180 top
Q4  BSS138W_SOT323  [MOS_SOT323]  124.21,117.76 180 top
Q5  XR65P02D  [PDFN3333]  214.08,93.59 90 top
Q6  BSS138W_SOT323  [MOS_SOT323]  128.3,117.69 180 top
Q7  BSS138W_SOT323  [MOS_SOT323]  132.53,117.63 180 top
Q8  BSS138W_SOT323  [MOS_SOT323]  191.56,120.64 270 top
Q9  BSS138W_SOT323  [MOS_SOT323]  191.56,124.03 270 top
Q10  AO3401_NC  [PMOS_SOT23]  210.02,35.78 270 top
Q11  AO3401_NC  [PMOS_SOT23]  87.34,60.12 270 top
R1  10K  [R0603]  128.59,94.47 0 top
R2  100K  [R0603]  128.54,100.65 270 top
R3  5.1K  [R0603]  233.42,85.09 0 top
R4  5.1K  [R0603]  233.47,79.56 180 top
R5  10K  [R0603]  206.96,84.68 90 top
R6  0R  [R0603]  233.41,83.27 0 top
R7  0R  [R0603]  233.41,81.43 0 top
R8  0R  [R0603]  200.76,74.62 90 top
R9  10K  [R0603]  202.6,84.73 270 top
R10  0R  [R0603]  198.7,74.6 90 top
R11  22.1K  [R0603]  130.04,100.65 90 top
R12  0R  [R0402]  114.37,95.54 0 top
R13  0R  [R0603]  127.53,85.39 180 top
R14  NC/499K  [R0603]  128.51,91.73 270 top
R15  10K  [R0603]  13.1,21.78 90 top
R16  2K  [R0603-SP]  170.49,9.56 0 top
R17  5.1K  [R0603]  179.2,12.35 0 top
R18  10K  [R0603]  219.95,84.62 180 top
R19  0R  [R0402]  101.88,95.4 180 top
R20  0R  [R0402]  99.65,95.61 0 top
R21  NC/499K  [R0603]  129.95,91.71 90 top
R22  4.7K  [R0603]  128.03,115.17 0 top
R23  0R  [C0402]  116.14,73.38 270 top
R24  0R  [R0603]  133.03,88.06 90 top
R25  0R  [R0603-SP]  105.96,57.79 270 top
R26  5.1K  [R0603]  233.91,74.97 180 top
R27  10K  [R0603]  14.83,21.76 90 top
R28  10K  [R0603]  19.06,21.6 90 top
R29  10K/NC  [R0603]  20.67,21.52 90 top
R30  10K  [R0603]  24.48,21.46 90 top
R31  2K  [R0603-SP]  202.59,68.82 180 top
R32  2K  [R0603-SP]  202.53,67.15 180 top
R33  10K  [R0603]  22.42,21.45 90 top
R35  NC/10M  [R0402]  98.03,92.45 90 top
R36  0R  [R0402]  97.16,88.07 90 top
R37  0R  [R0402]  96.74,83.44 90 top
R38  0R  [R0402]  99.6,75.77 180 top
R39  0R  [R0402]  117.47,83.45 270 top
R40  0R_NC  [R0402]  119.33,80.79 90 top
R41  0R  [R0402]  105.54,96.46 180 top
R42  0R  [R0402]  97.49,80.61 270 top
R43  0R  [R0402]  117.69,93.25 90 top
R44  0R  [R0402]  107.5,96.45 0 top
R45  4.7K  [R0603]  224.9,36.03 270 top
R46  4.7K  [R0603]  231.2,43.1 0 top
R47  5.1K  [R0603]  170.49,11.65 180 top
R48  0R  [R0603]  197.67,132.7 180 top
R49  0R  [R0603]  197.68,130.52 180 top
R50  5.1K  [R0603]  179.2,10.96 0 top
R51  4.7K  [R0603]  231.08,46.55 0 top
R52  4.7K  [R0603]  219.32,36.07 270 top
R53  10K  [R0603]  97.73,42.95 90 top
R54  10K  [R0603]  12.75,27.16 90 top
R55  0R  [R0603]  127.36,80.83 180 top
R56  4.7K  [R0603]  128.28,119.9 180 top
R57  4.7K  [R0603]  124.21,119.96 180 top
R58  4.7K  [R0603]  124.67,115.19 180 top
R59  4.7K  [R0603]  132.52,115.19 180 top
R60  0R  [R0603]  118.67,87.28 0 top
R61  10K  [R0603]  78.78,138.08 180 top
R62  4.7K  [R0603]  132.81,120.01 180 top
R63  100K  [R0402]  132.66,57.4 270 top
R64  100K  [R0402]  133.65,57.4 90 top
R65  0R  [R0603]  100.97,45.68 180 top
R65_NC  10K  [R0402]  90.14,80.14 90 top
R66  10K  [R0603]  78.69,143.77 180 top
R67  10K  [R0603]  131.58,130.09 270 top
R68  100K  [R0402]  116.26,59.56 90 top
R69  4.7K  [R0603-SP]  110.99,97.95 0 top
R70  0R  [R0402]  117.76,91.3 270 top
R71  10K  [R0603]  210.05,38.29 0 top
R72  10K  [R0402]  44.33,115.57 180 top
R73  10K  [R0402]  44.33,114.63 180 top
R74  4.7K  [R0603]  97.36,129.82 90 top
R75  4.7K  [R0603]  98.82,129.79 90 top
R76  0R  [R0603]  8.75,108.38 270 top
R77  10K  [R0603]  24.48,95.08 270 top
R78  4.7K  [R0603]  215.36,96.19 0 top
R79  OR  [R0603-SP]  63.9,15.43 0 top
R80  0R  [R0402]  106.89,75.76 0 top
R81  51K  [R0603]  29.74,95.12 90 top
R82  51K  [R0603]  31.14,95.12 90 top
R83  51K  [R0603]  32.56,95.12 90 top
R84  51K  [R0603]  33.99,95.12 90 top
R85  51K  [R0603]  35.41,95.12 90 top
R86  51K  [R0603]  36.84,95.12 90 top
R87  10K  [R0603]  28.33,95.12 90 top
R88  0R  [R0402]  79.45,91.72 90 top
R89  0R  [R0402]  76.61,91.78 90 top
R90  0R  [R0402]  78.08,91.75 90 top
R91  10K  [R0603]  201.07,84.71 90 top
R92  0R  [R0402]  104.83,73.56 90 top
R93  4.7K  [R0603]  197.41,123.36 180 top
R94  4.7K  [R0603]  197.42,121.11 180 top
R95  0R  [R0402]  102.93,73.56 90 top
R96  5.1K  [R0603]  233.98,64.09 0 top
R97  4.7K  [R0603]  186.32,120.1 0 top
R98  4.7K  [R0603]  186.32,121.52 0 top
R99  0R  [R0402]  102.04,73.56 90 top
R100  0R  [R0402]  103.53,76.36 90 top
R101  5.1K  [R0603]  234.04,61.07 180 top
R102  0R  [R0402]  104.43,76.36 90 top
R103  0R  [R0603]  131.42,91.7 90 top
R104  0R  [R0402]  101.71,76.42 90 top
R105  0R  [R0402]  95.63,80.14 90 top
R106  10K  [R0603]  118.67,88.79 180 top
R107  0R_NC  [R0402]  94.68,80.14 90 top
R108  100K  [R0402]  117.23,59.56 270 top
R109  0R  [R0402]  110.59,95.7 0 top
R110  0R  [R0402]  120.4,80.74 90 top
R111  0R  [R0402]  70.08,81.16 180 top
R112  0R_NC  [R0603]  72.38,18.39 270 top
R113  0R_NC  [R0603]  210.01,29.95 0 top
R114  0R_NC  [R0603]  210.01,31.35 0 top
R115  0R_NC  [R0603]  210.01,28.55 0 top
R116  10K  [R0603]  198.52,54.57 270 top
R117  100K_NC  [R0603]  210.04,33.18 180 top
R118  0R  [R0603]  188.94,71.64 0 top
R119  0R  [R0603]  188.94,69.74 0 top
R120  5.1K_NC  [R0603]  202.58,63.94 180 top
R121  5.1K_NC  [R0603]  202.56,65.59 180 top
R122  100K  [R0402]  119.28,59.56 90 top
R123  100K  [R0402]  118.31,59.56 270 top
R124  0R  [R0402]  44.33,116.52 180 top
R125  0R  [R0402]  44.33,117.46 180 top
R126  0R  [R0402]  117.53,73.43 270 top
R127  0R_NC  [R0402]  118.66,73.45 270 top
R128  0R  [R0402]  70.08,82.1 180 top
R129  0R_NC  [R0603]  73.84,18.39 270 top
R130  0R  [R0402]  70.08,82.99 180 top
R131  10K/NC  [R0402]  9.7,132.39 0 top
R132  OR/NC  [R0402]  9.7,131.42 180 top
R134  OR/NC  [R0402]  6.52,131.45 270 top
R139  100K_NC  [R0603]  70.78,18.34 90 top
R141  OR  [R0402]  9.7,135.26 0 top
R142  OR  [R0402]  9.7,136.26 0 top
R143  50K_NC  [R0603-SP]  76.8,18.39 270 top
R144  OR  [R0402]  7.42,131.45 90 top
R145  OR  [R0402]  9.7,134.3 0 top
R146  0R  [R0402]  34.45,105.78 180 top
R147  OR  [R0603-SP]  52.3,15.03 0 top
R148  0R  [R0402]  34.45,106.7 180 top
R149  0R_NC  [R0603]  75.35,18.39 270 top
R152  100R  [R0402]  108.07,73.58 270 top
R153  100R  [R0402]  108.92,73.58 270 top
R154  100R  [R0402]  110.85,73.58 270 top
R155  100R  [R0402]  111.74,73.58 270 top
R156  100R  [R0402]  110.28,76.28 270 top
R157  100R  [R0402]  109.38,76.28 270 top
R158  4.02K  [R0402]  112.28,76.28 270 top
R159  0.75R  [R0603-SP]  99.93,63.07 90 top
R160  10K  [R0603]  96.33,64.04 0 top
R161  0R_NC  [R0402]  40.99,99.67 90 top
R162  0R_NC  [R0402]  40.03,99.67 90 top
R163  NC  [R0603-SP]  101.33,63.07 90 top
R164  0R  [R0603]  165.41,10.48 90 top
R165  100K  [R0603]  85.28,46.96 180 top
R166  210K  [R0603]  85.11,54.34 90 top
R167  12K  [R0603]  83.68,54.33 270 top
R168  1.5K  [R0402]  120.34,59.55 270 top
R169  1K  [R0402]  123.39,59.55 270 top
R170  0R  [R0402]  41.34,109.26 0 top
R171  10K/NC  [R0402]  9.7,133.34 0 top
R172  3.9K  [R0603]  97.63,53.7 90 top
R173  51K  [R0603]  101.29,53.7 270 top
R174  3.9K  [R0603]  97.47,49.19 90 top
R175  51K  [R0603]  101.29,49.19 270 top
R177  0R  [R0402]  41.34,110.22 0 top
R178  20K  [R0603]  63.85,9.23 0 top
R179  20K  [R0603]  52.3,9.23 180 top
R180  10K  [R0603]  84.81,60.12 270 top
R181  10K  [R0603]  69.77,135.24 270 top
R182  0R  [R0805]  34.48,121.41 180 top
R184  0R  [R0603]  89.92,60.12 90 top
R185  OR  [R0603-SP]  52.3,6.13 0 top
R186  0R  [R0603]  163.29,10.42 90 top
R187  39k  [R0603]  202.55,59.21 180 top
R188  100k  [R0603]  202.52,62.42 0 top
R189  39k  [R0603]  188.91,66.27 0 top
R190  0R  [R0402]  105.72,73.56 90 top
R191  0R  [R0603]  17.69,27.13 90 top
R192  0R  [R0603]  19.73,27.18 90 top
R193  0R  [R0603]  22.05,27.18 90 top
R210  NC/10K  [R0603]  130.49,85.39 180 top
R216  0R  [R0402]  91.42,91.92 90 top
R217  0R  [R0402]  89.58,91.91 90 top
R332  0R  [R0402]  90.5,91.91 90 top
SW1  switch_6pin  [SWITCH_6PIN_2P]  242.35,100.92 90 top
TP1  TPTP08R  [TP08R]  118.25,133.2 0 top
TP2  TPTP08R  [TP08R]  119.63,133.23 0 top
TP3  TPTP08R  [TP08R]  119.84,131.58 0 top
TP4  TPTP08R  [TP08R]  121.46,131.58 0 top
TP5  TPTP08R  [TP08R]  121.52,133.23 0 top
TP6  TPTP08R  [TP08R]  123.05,133.26 0 top
TP7  TPTP08R  [TP08R]  128.45,60.48 0 top
TP8  TPTP08R  [TP08R]  126.86,60.48 0 top
TP9  TPTP08R  [TP08R]  126.83,58.8 0 top
TP10  TPTP08R  [TP08R]  125.3,58.8 0 top
TP11  TPTP08R  [TP08R]  125.3,61.92 0 top
TP12  TPTP08R  [TP08R]  123.83,61.92 0 top
TP13  TPTP08R  [TP08R]  124.7,133.23 0 top
TP14  TPTP08R  [TP08R]  137.06,138.15 0 top
TP15  TPTP08R  [TP08R]  126.71,133.71 0 top
TP16  TPTP08R  [TP08R]  135.77,133.86 0 top
TP17  TPTP08R  [TP08R]  136.49,135.06 0 top
U1  CH340K  [ESOP-10-EP-150MIL]  204.9,79.75 180 top
U2  TP4059-SOT23-6  [SOT23-6L]  174.87,11.72 90 top
U3  NS4168-NC  [NS4168-ESOP-8]  218.1,28.57 270 top
U4  NS4263B  [SOP16]  55.35,15.33 270 top
U5  STC8H1K08-36I  [TSSOP20]  196.13,67.06 0 top
U6  MT9201  [COOPER_SOT23-6]  96.33,61.53 90 top
U7  ESP32-P4NRW32  [IC_ESP32-P4NRW32]  106.34,86.25 0 top
U8  UMH3NTN  [SOP65P210X100-6N]  204.82,84.75 90 top
U9  MT3406_C22462728  [SOT95P280X145-5N]  128.65,96.99 0 top
U10  MT3406_C22462728  [SOT95P280X145-5N]  128.51,88.09 0 top
U13  NS4168-NC  [NS4168-ESOP-8]  73.41,12.25 270 top
U16  MT3608  [SOT95P280X145-6N]  85.31,49.91 270 top
U176  [BRAIN1_MIC-SMD_5P-L3.5-W2.7]  3.08,135.12 270 top
Y2  40MHZ  [X322540MPB4SI]  101.94,99.21 0 top
Y3  24Mhz  [24MHZ_1631-24003-BTKEYA]  128.45,130.03 180 top
Y4  32.768K  [NORDIC_NRF_XTAL_3215_N]  95.46,92.71 270 top

## Tracks (layer width: path | path; a pad name or v marks a point on that pad's centre or on a via)
3V3$
  Top 0.5: C2.2 202.2,75.56 U1.10
9
  cutout Top: 99.39,117.96 101.4,119.97 101.57,119.97 101.57,139.25 102.27,139.95 106.29,143.97 109.62,143.97 120.26,143.97 121.16,143.08 123.03,141.21 123.03,138.02 123.03,135.06 122.5,134.53 117.94,134.53 117.89,134.59 117.63,134.84 117.63,140.12 109.09,140.12 108.36,139.39 105.51,136.54 105.51,124.95 105.51,117.23 105.76,116.98 100.28,116.98 99.39,117.88
11
  cutout Top: 117.36,136.54 117.36,134.73 117.33,134.7 129.4,134.7 129.51,134.81 129.51,136.57 129.43,136.65 117.44,136.65 117.33,136.54
12
  cutout Top: 116.1,55.91 116.1,54.03 116.27,53.87 131.16,53.87 131.21,53.92 131.21,55.79 131.16,55.85 116.1,55.85
+5V_IN  (via drill 0.35)
  Top 0.61: D2.+ 221.2,91 D4.+
  Top 1: v242.09,39.06 241.08,40.07 J10.3 | R46.1 230.44,46.42 R51.1 224.57,46.55 224.2,46.92
  Top 1.5: D2.+ 221.66,90.16 224.2,87.61 224.2,46.92 224.2,44.41 228.54,40.07 J10.3
  Bottom 1: v242.09,39.06 242.12,39.03 243.26,39.03 P71.P$1
+VBUS1  (via drill 0.35)
  Top 0.12: 239.83,81.54 239.97,81.68 J1.A4
  Top 0.152: D11.+
  Top 0.3: J1.A9 239.8,86.33 | J1.A9 240.11,86.36 | 237.79,81.54 237.64,81.39 | J1.A4 240.12,81.56 J1.B9 239.97,81.68 | J1.A9 J1.B4
  Top 0.5: 242.16,85.16 240.96,86.36 240.11,86.36 | 242.16,82.76 240.96,81.56 240.12,81.56 | D11.+ 221.2,85.99 v221.54,85.65
  Top 0.6: 242.16,85.16 242.16,82.76 | 239.83,81.54 237.79,81.54
  Top 1: D10.+ 221.72,96.75 | 232.64,77.79 232.67,77.82
  Top 1.5: 221.72,96.75 224.07,96.75 229.46,91.35 v229.46,85.65 229.46,79.71 230.62,78.56 230.98,78.56 231.74,77.79 232.64,77.79 | 237.64,81.39 237.64,78.99 236.47,77.82 232.67,77.82
  Bottom 0.3: 229.49,85.68 v229.46,85.65 v229.46,86.31
  Bottom 0.5: v221.54,85.65 v229.46,85.65 | 229.46,87.6 P1.P$1
  Bottom 1: P1.P$1 229.49,85.68
+VBUS2  (via drill 0.35)
  Top 0.12: 238.14,65.57 237.84,65.27 | 240.09,60.63 J16.B9 | J16.A9 239.2,65.57 | J16.A9 J16.B4 | J16.A9 240.08,65.44 240.93,65.44
  Top 0.152: 239.91,60.66 239.94,60.63
  Top 0.3: J16.B4 237.84,65.27 | 239.2,65.57 238.14,65.57 | J16.B9 239.94,60.63 J16.A4
  Top 0.5: 240.09,60.63 240.91,60.63 242.28,62 242.28,64.09 240.93,65.44
  Top 0.6: 238.49,60.66 239.91,60.66
  Top 0.61: D007.+ 220.2,92.17 220.2,88.33 220.48,88.05 D008.+
  Top 1: 238.14,65.57 227.16,65.57 227.1,65.57 | D007.+ | 237.38,59.55 238.49,60.66 | v228.32,58.08 228.35,58.05 v228.98,58.05 228.63,58.4 228.63,59.88
  Top 1.5: 227.1,65.57 227.1,89.44 222.91,93.63 D007.+ | 227.16,65.57 227.16,61.35 228.63,59.88 228.96,59.55 237.38,59.55
  Bottom 1: P77.P$1 228.95,58.02 v228.98,58.05 | v228.32,58.08 228.35,58.11 228.86,58.11
ADC_AVDD_3V3
  Top 0.203: IC5.22 37.13,116.41 36.9,116.18 | IC5.23 37.17,116.01 37,116.18
  Top 0.508: FB5.2 35.45,114.78 C133.2 C132.1 36.53,115.71 37,116.18 36.9,116.18
ADC_DVDD_3V3  (via drill 0.3 pad 0.6)
  Top 0.25: IC5.7 42.54,118.01 42.7,117.85 | IC5.6 41.9,117.63 42.37,117.63 42.59,117.85
  Top 0.254: C130.1 44.23,118.64 44.23,118.59 44.44,118.38 45.18,118.38 45.19,118.38 46,118.38 46.57,117.81 46.57,115.27 v46.36,115.06 | R73.1 44.77,114.62 v44.77,113.72
  Top 0.406: FB4.2 C131.2 43.92,118.97 C130.1 43.81,118.96 43.27,118.41 42.7,117.85 42.59,117.85
  Bottom 0.254: v46.36,115.06 46.32,115.01 46.32,114.16 45.88,113.72
  Bottom 0.305: 45.88,113.72 v44.77,113.72
ADC_VBAT
  Top 0.3: U5.13 200.27,64.84 200.96,64.15 200.96,63.03 201.79,62.2 R187.2 201.73,59.26 C161.2 201.76,60.83 R188.1
AGND  (via drill 0.3 pad 0.6)
  Top 0.12: v47.33,9.86 46.33,9.86 v46.3,9.83 | J4.P$4 39.18,9.14 | J4.P$3 39.71,9.14
  Top 0.508: v46.3,9.83 45.62,9.14 39.71,9.14 39.18,9.14
  other vias: 51.45,5.13 56.95,7.43 64.75,5.13 62.15,13.93 54.05,13.93 54.41,16.96 54.45,18.83 65.85,15.43 72.25,12.93 73.35,12.93 74.55,12.93 72.25,12.03 73.45,12.03 74.55,12.03 67.65,16.13 74.05,8.13 72.45,8.13 73.25,8.13 69.25,20.13 62.45,20.33 60.95,20.33 59.65,20.43 54.51,19.86 54.49,17.88 54.05,7.23 56.85,14.13 77.93,19.28 77.55,10.83 67.65,12.53 69.82,10.95 70.75,2.83 74.95,4.13 77.48,5.38 56.41,19.86 56.21,16.66 41.27,3.23
  pour Top (no thermals): 31.82,11.07 46.16,11.07 50.9,15.81 52.1,15.81 52.64,16.35 52.64,20.37 53.18,20.91 77.93,20.91 78.41,20.43 78.41,3.06 77.51,2.16 32.36,2.16 31.31,3.21 31.31,10.56
  pour Bottom (no thermals): 31.79,11.07 46.13,11.07 50.87,15.81 52.07,15.81 52.61,16.35 52.61,20.37 53.15,20.91 77.9,20.91 78.38,20.43 78.38,3.06 77.48,2.16 32.33,2.16 31.28,3.21 31.28,10.56
AGND1  (via drill 0.3 pad 0.6, 0.35 pad 0.6)
  Top 0.102: v2.35,136.49 2.35,136.17 2.53,136 2.53,135.93
  Top 0.12: R145.2 10.93,134.3 v10.94,134.29 | 36.42,116.81 v36.3,116.68 | 2.93,135.01 2.93,134.86 | IC6.10 40.58,106.81 40.5,106.89
  Top 0.152: 32.15,119.48 C128.2 33.6,120.47 R182.2
  Top 0.2: IC5.21 36.42,116.81 | 40.5,106.89 39.34,106.89 v39.3,106.93
  Top 0.5: v2.35,136.49 2.37,136.47 U176.P$1 2.37,133.86 v2.35,133.84
  other vias: 2.47,137.62 6.06,137.7 12,137.45 8.65,137.64 10.95,133.24 33.6,114.93 33.6,115.83 33.6,118.33 33.05,118.99 34,111.13 35.4,109.33 34.1,107.73 34.1,104.83 35.5,102.93 35.6,104.73 35.6,103.83 38.76,103.01 46.7,104.93 45.8,102.93 46.7,106.53 36.3,111.13 37.4,111.13 38.6,111.13 39.7,111.13 41,111.13 6.95,134.64 3.6,132.17 33.8,113.13
  pour Top (no thermals): 12.4,138.34 2.05,138.34 1.35,137.64 1.35,132.14 4.55,128.94 17.2,128.94 33.6,112.53 33.6,104.13 35.7,102.03 46.1,102.03 47.1,103.03 47.1,106.93 47,107.03 44.4,107.03 44.1,106.73 44.1,104.93 43.2,104.03 39.8,104.03 39.7,104.13 39.7,110.33 40.2,110.83 41.5,110.83 41.9,111.23 41.9,112.33 41.8,112.43 36.6,112.43 36.6,119.73 34.51,121.82 28.92,121.82
  pour Bottom (no thermals): 12.57,138.34 2.05,138.34 1.35,137.64 1.35,132.14 4.55,128.94 17.2,128.94 33.6,112.53 33.6,104.13 35.7,102.03 46.1,102.03 47.1,103.03 47.1,106.93 47,107.03 44.4,107.03 44.1,106.73 44.1,104.9 43.23,104.03 39.8,104.03 39.7,104.13 39.7,110.43 40.1,110.83 41.5,110.83 41.9,111.23 41.9,112.33 41.8,112.43 36.6,112.43 36.6,119.73 34.48,121.85 29.06,121.85
AGND2  (via drill 0.35 pad 0.6)
  other vias: 240.91,132.96
AGND3  (via drill 0.35 pad 0.6)
  Top 0.102: FB20.2 222.44,23.47 222.44,24.47 222.41,24.5
  Top 0.12: 218.74,28.27 218.44,28.57 U3.9 217.73,28.57 v217.33,28.97 | FB20.2 222.44,24.47 222.41,24.5 | 217.67,23.41 C68.1 | 218.82,24.22 218.74,24.22 | C24.2 212.86,26.67 v213.15,26.96
  Top 0.3: C22.2 C23.2 C24.2 | 216.04,28.64 218.04,28.64 U3.9 | 218.74,28.47 218.74,28.27 U3.7 218.74,24.22 218.74,23.37 218.72,23.36 | 218.74,28.47 218.74,28.85 v218.86,28.97 | C68.1 218.72,23.36 | 218.72,23.36 C67.1 | 222.38,24.47 222.41,24.5 222.41,27.3 222.47,27.35 222.49,27.38 221.31,28.57 220.85,29.03 219.3,29.03 218.74,28.47
  Top 1: C22.2 C24.2 212.86,27.14 214.36,28.64 216.04,28.64 219.78,28.64 221.24,28.64 221.31,28.57 222.41,27.46 222.41,27.3 | 222.47,27.35 222.47,23.49
  Bottom 0.12: v218.86,28.97 v218.86,28.08 | v218.86,28.08 | v217.33,28.97 217.33,28.11 v217.38,28.05 217.41,28.08 v218.86,28.08
AUDIO_CTRL  (via drill 0.35)
  Top 0.152: v205.73,25.63 206.88,26.78 206.88,32.74 207.35,33.22 209.24,33.22 R117.2
  Top 0.2: R139.2 70.78,19.66 v71.35,20.23
  Top 0.5: R117.2 211.04,34.93 Q10.3
  Bottom 0.152: v205.73,25.63 205.72,25.62 128.67,25.62 117.61,14.56 114.94,14.56 114.75,14.75 83.74,14.75 78.27,20.23 v71.35,20.23
AUDIO_OUT_3V3  (via drill 0.3 pad 0.6)
  Top 0.61: FB15.2 62.52,17.66 C148.2 62.48,17.66 C134.2 C154.1 58.95,17.01 58.95,12.03 v59.15,11.83 59.46,11.52 U4.13 | U4.4 v56.75,11.53
  Bottom 0.61: v56.75,11.53 58.85,11.53 v59.15,11.83
AUDIO_OUT_SD  (via drill 0.35)
  Top 0.12: R147.1 51.54,15.12 52.45,16.03 54.35,16.03 55.36,17.04 55.36,22.62 56.66,23.92 v56.74,23.92 | Q10.1 206.3,36.67 205.37,35.73 v205.37,35.59 | 112.48,84.32 112.55,84.26 112.57,84.26 113.01,83.81 113.01,80.93 117.36,76.58 120.77,76.58 124.98,72.36 124.98,70.08 139.79,55.28 139.79,54.23
  Top 0.152: 139.79,54.23 139.79,35.51 v139.79,35.45 | U7.60 112.48,84.32
  Top 0.5: R71.1 209.29,36.95 Q10.1
  Bottom 0.152: 142.36,35.45 v139.79,35.45 139.65,35.31 111.96,35.31 98.94,22.29 83.85,22.29 75.49,30.66 72.26,30.66 71.87,30.27 71.87,26.26 70.28,24.67 57.49,24.67 v56.74,23.92
  Bottom 0.3: 142.36,35.45 205.23,35.45 v205.37,35.59
AUDIO_VDD1
  Top 0.508: FB17.1 C104.1 69.28,17.52 C102.1 C103.1 70.85,12.02 70.85,11.33 71.45,10.73 71.95,10.73 72.78,9.9 U13.6
AUDIO_VDD2
  Top 0.508: FB18.1 C22.1 C23.1 C24.1 214.39,26.12 215.31,27.05 217.01,27.05 217.47,26.59 U3.6
AUDIO_VDD_3V3  (via drill 0.35)
  Top 0.12: v15.22,130.95 v15.24,130.95 | 65.2,134.49 IC7.5
  Top 0.152: v46.58,112.43 47.44,112.43 47.5,112.48 | 33.12,114.16 33.41,114.16 33.68,113.9 | 12.33,130.96 12.33,131.06 | 15.11,131.06 v15.22,130.95
  Top 0.3: 33.2,114.08 33.12,114.16 32.98,114.3 32.98,116.03 v29.16,119.85 16.23,132.78
  Top 0.5: v15.22,132.78 | 16.23,132.78 v15.22,132.78 | 11.16,129.79 12.33,130.96
  Top 0.508: FB6.1 5.44,130.31 5.96,129.79 11.16,129.79 | 33.38,113.9 33.68,113.9 FB5.1
  Top 0.524: 12.33,131.06 15.11,131.06
  Top 0.61: FB4.1 44.85,120.87 45.07,120.87 45.88,120.05 v46.06,120.05 47.5,118.62 47.5,112.48 47.5,111.02 45.78,109.3 FB14.1
  Top 1: 65.2,134.49 C152.2 C153.2 FB16.2 60.75,134.4 55.26,128.91 | v54.78,128.43 55.26,128.91 | 55.26,128.91 v55.27,128.91
  Bottom 0.152: 15.29,132.71 v15.22,132.78 | 29.37,120.05 v29.16,119.85 | v29.16,119.85
  Bottom 0.5: v15.24,130.95 15.24,132.51 15.29,132.57 15.29,132.71
  Bottom 1: 29.37,120.05 v46.06,120.05 46.3,120.05 54.68,128.43 v54.78,128.43 55.26,128.91 v55.27,128.91
AVDD_2V8  (via drill 0.35)
  Top 0.25: 85.36,141.92 86.13,141.92
  Top 0.3: 128.67,137.08 128.84,137.25 | FPC1.2 128.84,137.25 | 128.84,137.25 128.93,137.34 129.34,136.93 FPC1.1 | v128.15,141.82 131.6,141.82 134.24,139.17 P74.P$1
  Top 0.61: IC3.5 83.18,142.11 C82.2 C83.2 85.36,141.92 85.48,142.04 v85.76,142.04
  Top 1: 86.13,141.92 v86.43,141.63 | v128.94,141.84 128.91,141.82 v128.15,141.82 128.36,141.82 128.93,141.24 128.93,137.34
  Bottom 0.12: v128.94,141.84 128.88,141.84 128.78,141.93
  Bottom 0.152: 88.11,141.77 86.62,141.77
  Bottom 0.25: v128.15,141.82 128.03,141.93 127.68,141.93 | 85.87,141.77 85.76,141.65 v85.76,142.04 | 86.62,141.77 86.79,141.93 86.26,141.93 86.34,141.85 86.34,141.54 v86.43,141.63
  Bottom 0.8: 128.78,141.93 127.68,141.93 86.79,141.93
  Bottom 1: 86.62,141.77 85.87,141.77
C6_EN  (via drill 0.3 pad 0.6, 0.35)
  Top 0.12: U7.63 112.29,85.37 112.5,85.59 113.03,85.59 113.55,85.07 113.55,81.11 117.44,77.21 120.92,77.21 125.95,72.18 v125.95,71.37 | v39.67,97.38 39.67,83.81 44.55,78.93 67.7,78.93 68.94,77.69 68.94,68.9 v68.82,68.79 | v27.6,97.18 27.35,97.18 C15.1 R77.1 13.33,106.99 13.33,112.15 12.63,112.85 IC1.8
  Bottom 0.12: v68.82,68.79 71.06,68.79 71.67,68.18 110.67,68.18 112.19,69.7 115.45,69.7 117.26,71.51 125.81,71.51 v125.95,71.37
  Bottom 0.152: v27.6,97.18 28.12,97.7 31.47,97.7 31.94,98.18 37.08,98.18 37.84,97.43 39.63,97.43 v39.67,97.38
C6_IO8
  Top 0.152: R87.2 28.4,95.95 28.4,101 27.08,102.31 27.08,113.97 17.59,123.45 IC1.22
C6_IO9_BOOT  (via drill 0.35 pad 0.6)
  Top 0.3: IC1.23 15.31,124.25 v14.89,124.67
  Bottom 0.3: P36.P$1 14.89,124.74 v14.89,124.67
C6_RXD0  (via drill 0.3 pad 0.6)
  Top 0.12: IC1.30 11.03,126.84 v11.43,127.23
  Bottom 0.12: P21.P$1 11.55,127.36 v11.43,127.23
C6_TXD0  (via drill 0.3 pad 0.6)
  Top 0.12: v10.23,127.23
  Top 0.152: IC1.31 v10.23,127.23
  Bottom 0.12: v10.23,127.23 10.21,127.23 P25.P$1
C6_VDD_3V3  (via drill 0.35)
  Top 0.3: 8.63,109.26 R76.1
  Top 0.4: IC1.3 8.63,109.26
  Top 0.5: 23.7,94.32 19.54,94.32 12.5,101.36 12.5,108.32 C14.2 11.67,110.15 v11.71,110.19
  Top 0.508: 23.7,94.32 R77.2 25.72,93.08 27.05,93.08 R87.1 R81.1 R82.1 R83.1 R84.1 R85.1 R86.1
  Top 0.61: C14.2 C11.1 R76.1
  Bottom 0.5: P39.P$1 v11.71,110.19
CODEC_3V3  (via drill 0.3 pad 0.6)
  Top 0.2: IC6.4 43.78,105.51 v43.78,105.48 43.42,105.11 IC6.3 | FB13.2 36.51,108.8 36.9,109.19 37.89,109.19 39.22,107.86 42.52,107.86 v42.74,108.08
  Top 0.406: FB14.2 C145.1 44.89,105.71 C146.2 44.69,105.48 v43.78,105.48 | v43.78,105.48
  Bottom 0.2: v43.78,105.48 43.75,105.48 43.75,107.03 42.74,108.05 v42.74,108.08
CSI_CLK_N  (via drill 0.2 pad 0.4)
  Top 0.12: R156.2 110.28,75.71 109.93,75.35 109.93,71.17 110.11,70.98 110.31,70.98 v110.46,71.13 | v84.44,88.4 84.26,88.57 84.26,106.58 88.8,111.11 96.5,111.11 103.94,118.55 103.94,137.57 108.5,142.13 118.38,142.13 120.34,140.17 FPC1.19 120.34,132.08 TP3.TP
  Bottom 0.12: v110.46,71.13 110.26,70.93 109.6,70.93 108.78,71.76 87.07,71.76 84.24,74.6 84.24,88.17 84.44,88.37 v84.44,88.4
CSI_CLK_P  (via drill 0.2 pad 0.4)
  Top 0.12: v110.5,70.55 110.35,70.7 110.05,70.7 109.6,71.15 109.6,75.62 R157.2 | v83.88,88.4 83.88,88.44 84.01,88.57 84.01,106.63 88.7,111.33 96.15,111.33 103.58,118.76 103.58,137.74 108.22,142.38 118.56,142.38 120.84,140.09 FPC1.18 120.84,132.2 TP4.TP
  Bottom 0.12: v83.88,88.4 83.88,88.34 84.01,88.21 84.01,74.46 86.94,71.53 108.6,71.53 109.45,70.69 110.36,70.69 v110.5,70.55
CSI_D0_N  (via drill 0.2 pad 0.4)
  Top 0.12: R152.2 108.47,72.74 108.47,71.3 108.11,70.93 107.5,70.93 v107.4,71.03 | v83.4,87.57 83.22,87.75 83.22,106.44 88.6,111.83 95.73,111.83 102.74,118.84 102.74,138.05 107.59,142.9 119.77,142.9 121.84,140.83 FPC1.16 121.84,133.58 121.52,133.26 TP5.TP
  Bottom 0.12: v107.4,71.03 107.26,70.89 86.33,70.89 83.19,74.03 83.19,87.37 v83.39,87.57 v83.4,87.57
CSI_D0_P  (via drill 0.2 pad 0.4)
  Top 0.12: R153.2 108.92,72.94 108.72,72.74 108.72,71.16 108.21,70.64 107.58,70.64 v107.41,70.47 | v82.82,87.59 82.99,87.76 82.99,106.53 88.51,112.05 95.42,112.05 102.46,119.09 102.46,138.25 107.41,143.19 119.81,143.19 122.34,140.66 FPC1.15 122.34,133.67 122.75,133.26 TP6.TP